# Altium schematic sheet DRV10975 3-ph Sensorless BLDC Motor Driver.SchDoc: DRV10975 BLDC Motor Driver
size A4
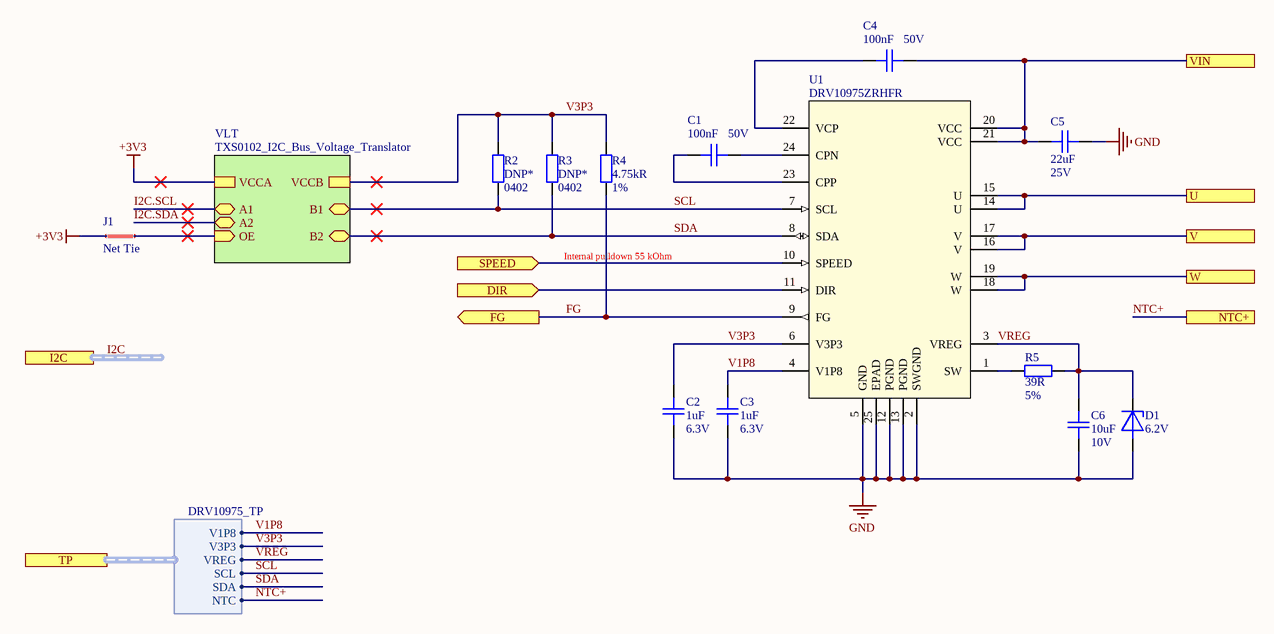
[diagram p0: DRV10975 3-ph Sensorless BLDC Motor Driver.SchDoc]

## Parts
C1  Capacitance: 100nF  Voltage: 50V  [C0402]  (hidden comment: CAP CER 0.1UF 50V X7R 0402)
C2  Capacitance: 1uF  Voltage Rating: 6.3V  [C0402]  (hidden comment: CAP CER 1UF 6.3V X5R 0402)
C3  Capacitance: 1uF  Voltage Rating: 6.3V  [C0402]  (hidden comment: CAP CER 1UF 6.3V X5R 0402)
C4  Capacitance: 100nF  Voltage: 50V  [C0402]  (hidden comment: CAP CER 0.1UF 50V X7R 0402)
C5  Capacitance: 22uF  Voltage Rating: 25V  [C0805]  (hidden comment: CAP CER 22UF 25V X5R 0805)
C6  Capacitance: 10uF  Voltage Rating: 10V  [C0805]  (hidden comment: CAP CER 10uF X7R 10% 0805)
D1  Zener Voltage: 6.2V  [SOD-123FL]  (hidden comment: Zener Diode 6.2V 2.5W ±5% Surface Mount SOD-123FL)
J1  Net Tie  [Net Tie 6x30mil]  (net tie, no BOM)
R2  DNP*  Case/Package: 0402  [R0402]  (no BOM)
R3  DNP*  Case/Package: 0402  [R0402]  (no BOM)
R4  Resistance: 4.75kR  Tolerance: 1%  [R0402]  (hidden comment: RES SMD 4.75K OHM 1% 1/16W 0402)
R5  Resistance: 39R  Tolerance: 5%  [R1206]  (hidden comment: RES SMD 39 OHM 1% 1/4W 1206)
U1  DRV10975ZRHFR  [RHF24_2P65X3P65]

## Sub-sheets
VLT = TXS0102_I2C_Bus_Voltage_Translator: VCCA, VCCB, OE (in), A1 (bidir), A2 (bidir), B1 (bidir), B2 (bidir)

## Ports
DIR (in), FG (out), I2C (harness I2C), NTC+, SPEED (in), TP (harness DRV10975_TP), U, V, VIN, W

## Harnesses
DRV10975_TP: V3P3, V1P8, VREG, SCL, SDA, NTC

## Nets
+3V3: J1.1 ; sheet VLT/VCCA
GND: C2.1 C3.1 C5.2 C6.2 D1.2(A) U1.2(SWGND) U1.5(GND) U1.12(PGND) U1.13(PGND) U1.25(EPAD)
DIR: U1.11(DIR) ; port DIR
FG: R4.2 U1.9(FG) ; port FG
I2C.SCL: sheet VLT/A1
I2C.SDA: sheet VLT/A2
NTC+: port NTC+, port TP.NTC
SCL: R2.1 U1.7(SCL) ; sheet VLT/B1, port TP.SCL
SDA: R3.1 U1.8(SDA) ; sheet VLT/B2, port TP.SDA
SPEED: U1.10(SPEED) ; port SPEED
U: U1.14(U) U1.15(U) ; port U
V: U1.16(V) U1.17(V) ; port V
V1P8: C3.2 U1.4(V1P8) ; port TP.V1P8
V3P3: C2.2 R2.2 R3.2 R4.1 U1.6(V3P3) ; sheet VLT/VCCB, port TP.V3P3
VIN: C4.2 C5.1 U1.20(VCC) U1.21(VCC) ; port VIN
VREG: C6.1 D1.1(K) R5.2 U1.3(VREG) ; port TP.VREG
W: U1.18(W) U1.19(W) ; port W
NetC1_1: C1.1 U1.23(CPP)
NetC1_2: C1.2 U1.24(CPN)
NetC4_1: C4.1 U1.22(VCP)
NetJ1_2: J1.2 ; sheet VLT/OE
NetR5_1: R5.1 U1.1(SW)

## Buses and harness runs
harness I2C = port I2C

## Notes on the sheet
- (near U1) Internal pulldown 55 kOhm
- Title
- Size:
- Date:
- A4
- Number:
- Time:
- Revision:
- Sheet
- of
- File:

## Library data of the parts
C1 C4 = CAP CER 0.1UF 50V X7R 0402: 0.1µF ±10% 50V Ceramic Capacitor X7R 0402 (1005 Metric); Manufacturer: TDK; Manufacturer Part Number: CGA2B3X7R1H104K050BB; Supplier 1: Digi-Key; Stock 1: 2925303; Pricing 1: 1=0.17, 10=0.118, 50=0.0668, 100=0.0553, 500=0.0388, 1000=0.0321, 2500=0.0299, 5000=0.0273 (USD); Mount: Surface Mount; Case/Package: 0402; Weight: 2.3E-05oz; Case Code (Metric): 1005; Case Code (Imperial): 0402; Min Operating Temperature: -55°C; Max Operating Temperature: 125°C; Voltage Rating: 50V; Tolerance: 10%; Packaging: Tape and Reel; Package Quantity: 1; Voltage Rating (DC): 50V; Dielectric: X7R; Termination: SMD/SMT; Composition: Ceramic; Length: 1mm; Height: 0.5mm; Width: 0.02inch; Thickness: 0.022inch; Depth: 0.5mm; Ratings: AEC-Q200; REACH SVHC: No SVHC; Lead Free: Lead Free; ComponentLink1URL: http://product.tdk.com/capacitor/mlcc/en/documents/mlccspec_automotive_general_midvoltage_en.pdf?src-supplier=Future+Electronics; ComponentLink1Description: http://product.tdk.com/capacitor/mlcc/en/documents/mlccspec_automotive_general_midvoltage_en.pdf?src-supplier=Future+Electronics; ComponentLink2URL: http://www.farnell.com/datasheets/1807242.pdf?src-supplier=Element14; ComponentLink2Description: http://www.farnell.com/datasheets/1807242.pdf?src-supplier=Element14; ComponentLink3URL: http://www.mouser.com/ds/2/400/lcc_automotive_general_en-843974.pdf?src-supplier=Mouser; ComponentLink3Description: http://www.mouser.com/ds/2/400/lcc_automotive_general_en-843974.pdf?src-supplier=Mouser; ComponentLink4URL: http://www.farnell.com/datasheets/1936565.pdf?src-supplier=Element14; ComponentLink4Description: http://www.farnell.com/datasheets/1936565.pdf?src-supplier=Element14; ComponentLink5URL: http://www.farnell.com/datasheets/1735392.pdf?src-supplier=Element14; ComponentLink5Description: http://www.farnell.com/datasheets/1735392.pdf?src-supplier=Element14; Supplier Part Number 1: 445-6899-1-ND
C2 C3 = CAP CER 1UF 6.3V X5R 0402: 1µF ±10% 6.3V Ceramic Capacitor X5R 0402 (1005 Metric); Manufacturer: Yageo; Manufacturer Part Number: CC0402KRX5R5BB105; Supplier 1: Digi-Key; Stock 1: 34926286; Pricing 1: 1=0.1, 10=0.05, 50=0.0272, 100=0.0222, 500=0.0158, 1000=0.0124, 2500=0.0113, 5000=0.0104 (USD); Mount: Surface Mount; Case/Package: 0402; Number of Pins: 2; Case Code (Metric): 1005; Case Code (Imperial): 0402; Dielectric Material: Ceramic; Min Operating Temperature: -55°C; Max Operating Temperature: 85°C; Tolerance: 10%; Voltage Rating (DC): 6.3V; Package Quantity: 1; Packaging: Tape and Reel; Dielectric: X5R; Termination: SMD/SMT; Composition: Ceramic; Length: 1mm; Height: 0.5mm; Width: 0.02inch; Thickness: 0.022inch; Depth: 0.5mm; Radiation Hardening: No; REACH SVHC: No SVHC; Lead Free: Lead Free; Halogen Free: Halogen Free; ComponentLink1URL: http://www.farnell.com/datasheets/70765.pdf?src-supplier=Farnell; ComponentLink1Description: http://www.farnell.com/datasheets/70765.pdf?src-supplier=Farnell; ComponentLink2URL: http://www.yageo.com/documents/recent/UPY-GPHC_X5R_4V-to-50V_25.pdf?src-supplier=Digi-Key; ComponentLink2Description: http://www.yageo.com/documents/recent/UPY-GPHC_X5R_4V-to-50V_25.pdf?src-supplier=Digi-Key; ComponentLink3URL: http://www.farnell.com/datasheets/2167237.pdf?src-supplier=Element14; ComponentLink3Description: http://www.farnell.com/datasheets/2167237.pdf?src-supplier=Element14; ComponentLink4URL: http://www.yageo.com/documents/recent/UPY-GPHC_X5R_4V-to-50V_12.pdf?src-supplier=Avnet+Europe; ComponentLink4Description: http://www.yageo.com/documents/recent/UPY-GPHC_X5R_4V-to-50V_12.pdf?src-supplier=Avnet+Europe; ComponentLink5URL: http://www.farnell.com/datasheets/1359354.pdf?src-supplier=Element14; ComponentLink5Description: http://www.farnell.com/datasheets/1359354.pdf?src-supplier=Element14; ComponentLink6URL: http://www.farnell.com/datasheets/70765.pdf?src-supplier=Element14; ComponentLink6Description: http://www.farnell.com/datasheets/70765.pdf?src-supplier=Element14; ComponentLink7URL: http://www.yageo.com/documents/recent/UPY-GPHC_X5R_4V-to-50V_12.pdf?src-supplier=Avnet; ComponentLink7Description: http://www.yageo.com/documents/recent/UPY-GPHC_X5R_4V-to-50V_12.pdf?src-supplier=Avnet; Supplier Part Number 1: 311-1438-1-ND
C5 = CAP CER 22UF 25V X5R 0805: 22µF ±20% 25V Ceramic Capacitor X5R 0805 (2012 Metric); Manufacturer: Yageo; Manufacturer Part Number: CC0805MKX5R8BB226; Supplier 1: Digi-Key; Stock 1: 1060; Pricing 1: 1=0.5, 10=0.353, 50=0.267, 100=0.2325, 500=0.1722, 1000=0.1464 (USD); Mount: Surface Mount; Case/Package: 0805; Case Code (Imperial): 0805; Case Code (Metric): 2012; Min Operating Temperature: -55°C; Max Operating Temperature: 85°C; Packaging: Tape and Reel; Tolerance: 20%; ComponentLink1URL: http://www.yageo.com/documents/recent/UPY-GPHC_X5R_4V-to-50V_25.pdf?src-supplier=Digi-Key; ComponentLink1Description: http://www.yageo.com/documents/recent/UPY-GPHC_X5R_4V-to-50V_25.pdf?src-supplier=Digi-Key; ComponentLink2URL: http://www.mouser.com/ds/2/447/Yageo_UPY-GP_NP0_16V-to-50V_9-358835.pdf?src-supplier=Mouser; ComponentLink2Description: http://www.mouser.com/ds/2/447/Yageo_UPY-GP_NP0_16V-to-50V_9-358835.pdf?src-supplier=Mouser; Supplier Part Number 1: 311-1903-1-ND; Package Quantity: 3000; Dielectric: X5R; Length: 0.079inch; Width: 0.049inch; Thickness: 0.057inch; Voltage Rating (DC): 25V; Termination: SMD/SMT; Height: 1.25mm; Weight: 0.000194oz; Lead Free: Lead Free; Halogen Free: Halogen Free
C6 = CAP CER 10uF X7R 10% 0805: Capacitor,10uF,10V,X7R,10%,0805,Murata; Manufacturer Part Number: GRM21BR71A106KA73L; Supplier 1: Digi-Key; Manufacturer: Murata; Stock 1: 2099435; Pricing 1: 1=0.26, 10=0.176, 100=0.089, 500=0.0609, 1000=0.0538 (USD); Mount: Surface Mount; Case/Package: 0805; Weight: 0.000335oz; Case Code (Metric): 2012; Case Code (Imperial): 0805; Min Operating Temperature: -55°C; Max Operating Temperature: 125°C; Packaging: Tape and Reel; Tolerance: 10%; Dielectric: X7R; Voltage Rating (DC): 10V; Package Quantity: 3000; Termination: SMD/SMT; Length: 2mm; Height: 1.25mm; Width: 1.25mm; Thickness: 0.055inch; Supplier Part Number 1: 490-10516-1-ND; Depth: 1.25mm; REACH SVHC: No SVHC; ComponentLink1URL: http://components.arrow.com/part/dataview/0323_07281730?src-supplier=Arrow+Europe; ComponentLink1Description: http://components.arrow.com/part/dataview/0323_07281730?src-supplier=Arrow+Europe; ComponentLink2URL: http://www.mouser.com/ds/2/281/c02e-2905.pdf?src-supplier=Mouser; ComponentLink2Description: http://www.mouser.com/ds/2/281/c02e-2905.pdf?src-supplier=Mouser; ComponentLink3URL: http://www.farnell.com/datasheets/2079188.pdf?src-supplier=Newark; ComponentLink3Description: http://www.farnell.com/datasheets/2079188.pdf?src-supplier=Newark; ComponentLink4URL: http://www.farnell.com/datasheets/2079188.pdf?src-supplier=Farnell; ComponentLink4Description: http://www.farnell.com/datasheets/2079188.pdf?src-supplier=Farnell; ComponentLink5URL: http://www.farnell.com/datasheets/2079188.pdf?src-supplier=Element14; ComponentLink5Description: http://www.farnell.com/datasheets/2079188.pdf?src-supplier=Element14; ComponentLink6URL: http://search.murata.co.jp/Ceramy/image/img/A01X/G101/ENG/GRM21BR71A106KA73-01.pdf?src-supplier=Digi-Key; ComponentLink6Description: http://search.murata.co.jp/Ceramy/image/img/A01X/G101/ENG/GRM21BR71A106KA73-01.pdf?src-supplier=Digi-Key
D1 = DIODE ZENER 6.2V 2.5W SOD123FL: Manufacturer: ON Semiconductor; Manufacturer Part Number: 1SMF5920BT1G; Max Reverse Leakage Current: 5uA; Impedance: 2R; Working Voltage: 4V; Element Configuration: Single; Direction: Unidirectional; Supplier 1: Digi-Key; Stock 1: 1919; Pricing 1: 1=0.46, 10=0.391, 25=0.3652, 100=0.2712, 250=0.2576, 500=0.2117, 1000=0.1721 (USD); Case/Package: SOD-123-2; Number of Pins: 2; Contact Plating: Tin,Matte; Min Operating Temperature: -55°C; Max Operating Temperature: 150°C; Package Quantity: 3000; Tolerance: 5%; Packaging: Tape and Reel; Voltage Tolerance: 5%; Power Dissipation: 2.5W; Max Power Dissipation: 2.5W; Leakage Current: 5uA; Length: 2.7mm; Depth: 1.65mm; Radiation Hardening: No; Lead Free: Lead Free; ComponentLink1URL: http://www.mouser.com/ds/2/308/1SMF5920B-D-108688.pdf?src-supplier=Mouser; ComponentLink1Description: http://www.mouser.com/ds/2/308/1SMF5920B-D-108688.pdf?src-supplier=Mouser; ComponentLink2URL: http://components.arrow.com/part/dataview/50999384S92509N5236?src-supplier=Arrow; ComponentLink2Description: http://components.arrow.com/part/dataview/50999384S92509N5236?src-supplier=Arrow; ComponentLink3URL: http://www.onsemi.com/pub/Collateral/1SMF5920B-D.PDF?src-supplier=Digi-Key; ComponentLink3Description: http://www.onsemi.com/pub/Collateral/1SMF5920B-D.PDF?src-supplier=Digi-Key; ComponentLink4URL: http://www.onsemi.com/pub_link/Collateral/1SMF5920B-D.PDF?src-supplier=Avnet; ComponentLink4Description: http://www.onsemi.com/pub_link/Collateral/1SMF5920B-D.PDF?src-supplier=Avnet; Supplier Part Number 1: 1SMF5920BT1GOSCT-ND; Mount: Surface Mount
J1 = Net Tie Line: ClassName: Net Tie
R2 R3 = RES SMD NO BOM 0402: Placeholder for a 0402 resistor
R4 = RES SMD 4.75K OHM 1% 1/16W 0402: 4.75 kOhms ±1% 0.063W, 1/16W Chip Resistor 0402 (1005 Metric) Moisture Resistant Thick Film; Manufacturer: Yageo; Manufacturer Part Number: RC0402FR-074K75P; Max Power Dissipation: 63mW; Temperature Coefficient: 150ppm/°C; Supplier 1: Digi-Key; Stock 1: 23485; Pricing 1: 1=0.1, 10=0.035, 100=0.014, 1000=0.0063, 2500=0.0055, 5000=0.0045 (USD); Case/Package: 0402; Case Code (Metric): 1005; Case Code (Imperial): 0402; Min Operating Temperature: -55°C; Max Operating Temperature: 155°C; Packaging: Tape and Reel; Composition: Thick Film; Number of Terminations: 2; Features: Moisture Resistant; Length: 0.039inch; Height: 0.016inch; Width: 0.02inch; ComponentLink1URL: http://www.yageo.com/NewPortal/yageodocoutput?fileName=/pdf/R-Chip/PYu-RC_51_RoHS_P_0.pdf&src-supplier=Digi-Key; ComponentLink1Description: http://www.yageo.com/NewPortal/yageodocoutput?fileName=/pdf/R-Chip/PYu-RC_51_RoHS_P_0.pdf&src-supplier=Digi-Key; ComponentLink2URL: http://www.yageo.com.tw/exep/pages/download/literatures/PYu-R_INT-thick_7.pdf?src-supplier=Digi-Key; ComponentLink2Description: http://www.yageo.com.tw/exep/pages/download/literatures/PYu-R_INT-thick_7.pdf?src-supplier=Digi-Key; Supplier Part Number 1: YAG1271CT-ND; Mount: Surface Mount
R5 = RES SMD 39 OHM 1% 1/4W 1206: 39 Ohms ±5% 0.25W, 1/4W Chip Resistor 1206 (3216 Metric) Moisture Resistant Thick Film; Manufacturer: Yageo; Manufacturer Part Number: RC1206JR-0739RL; Voltage Rating: 200V; Power Rating: 250mW; Temperature Coefficient: 100ppm/°C; Supplier 1: Digi-Key; Stock 1: 98107; Pricing 1: 1=0.1, 10=0.061, 100=0.0249, 1000=0.0112, 2500=0.0097 (USD); Case/Package: 1206; Number of Pins: 2; Weight: 0.000571oz; Case Code (Imperial): 1206; Case Code (Metric): 3216; Contact Plating: Tin,Matte; Min Operating Temperature: -55°C; Max Operating Temperature: 155°C; Packaging: Tape and Reel; Voltage Rating (DC): 200V; Composition: Thick Film; Termination: SMD/SMT; Military Standard: Not; Length: 3.2mm; Height: 0.55mm; Width: 1.6mm; Depth: 1.6mm; Radiation Hardening: No; Lead Free: Lead Free; REACH SVHC: Unknown; ComponentLink1URL: http://www.yageo.com/documents/recent/PYu-RC1206_51_RoHS_L-4.pdf?src-supplier=Future+Electronics; ComponentLink1Description: http://www.yageo.com/documents/recent/PYu-RC1206_51_RoHS_L-4.pdf?src-supplier=Future+Electronics; ComponentLink2URL: http://www.farnell.com/datasheets/444357.pdf?src-supplier=Element14; ComponentLink2Description: http://www.farnell.com/datasheets/444357.pdf?src-supplier=Element14; ComponentLink3URL: https://produktinfo.conrad.com/datenblaetter/400000-424999/402370-da-01-en-SMD_Widerstand_Chip1206_39_Ohm.pdf?src-supplier=Conrad; ComponentLink3Description: https://produktinfo.conrad.com/datenblaetter/400000-424999/402370-da-01-en-SMD_Widerstand_Chip1206_39_Ohm.pdf?src-supplier=Conrad; Supplier Part Number 1: 311-39ERCT-ND; Mount: Surface Mount
U1 = IC DRV10975Z BLDC MOTOR DRIVER VQFN-24: Multiphase Motor Driver Power MOSFET Analog, I²C, PWM 24-VQFN (5x4); Manufacturer: Texas Instruments; Number of Outputs: 3 Output; Operating Frequency: 100 kHz; Output Current: 1.5 A; Output Voltage: 19 V; Development Kit: DRV10975EVM; Operating Supply Current: 5 mA; Operating Supply Voltage: 6.5 V to 18 V; Manufacturer Part Number: DRV10975ZRHFR; RoHS: RoHS Compliant; Category: Motor / Motion / Ignition Controllers & Drivers; Stock 1: 2979; Pricing 1: 1=2.73, 10=2.31, 100=1.85, 250=1.62, 500=1.58, 1000=1.25, 3000=1.21, 6000=1.16, 9000=1.14 (USD); Features: Buck Step Down Converter, Initial Position Detect (IPD), Rotor Lock Protection, SPI/I2C, Integrated; Operating Temperature Range: - 40 C to + 125 C; Package / Case: VQFN-24; Packaging: Cut Tape; Product: Brushless DC Motor Controllers; Series: DRV10975; Type: Half Bridge; Brand: Texas Instruments; Mount: Surface Mount; Maximum Operating Temperature: + 125 C; Minimum Operating Temperature: - 40 C; Moisture Sensitive: Yes; Product Type: Motor / Motion / Ignition Controllers & Drivers; Standard Pack Qty: 3000; Subcategory: PMIC - Power Management ICs; RoHS - Mouser: Y; Minimum Order Quantity: 1; Reeling: True; Supplier 1: Digi-Key; Supplier Part Number 1: 296-50214-1-ND